# EAGLE board Room-Monitoring V.1.0 (EAGLE 7.2.0), part 1 of 2
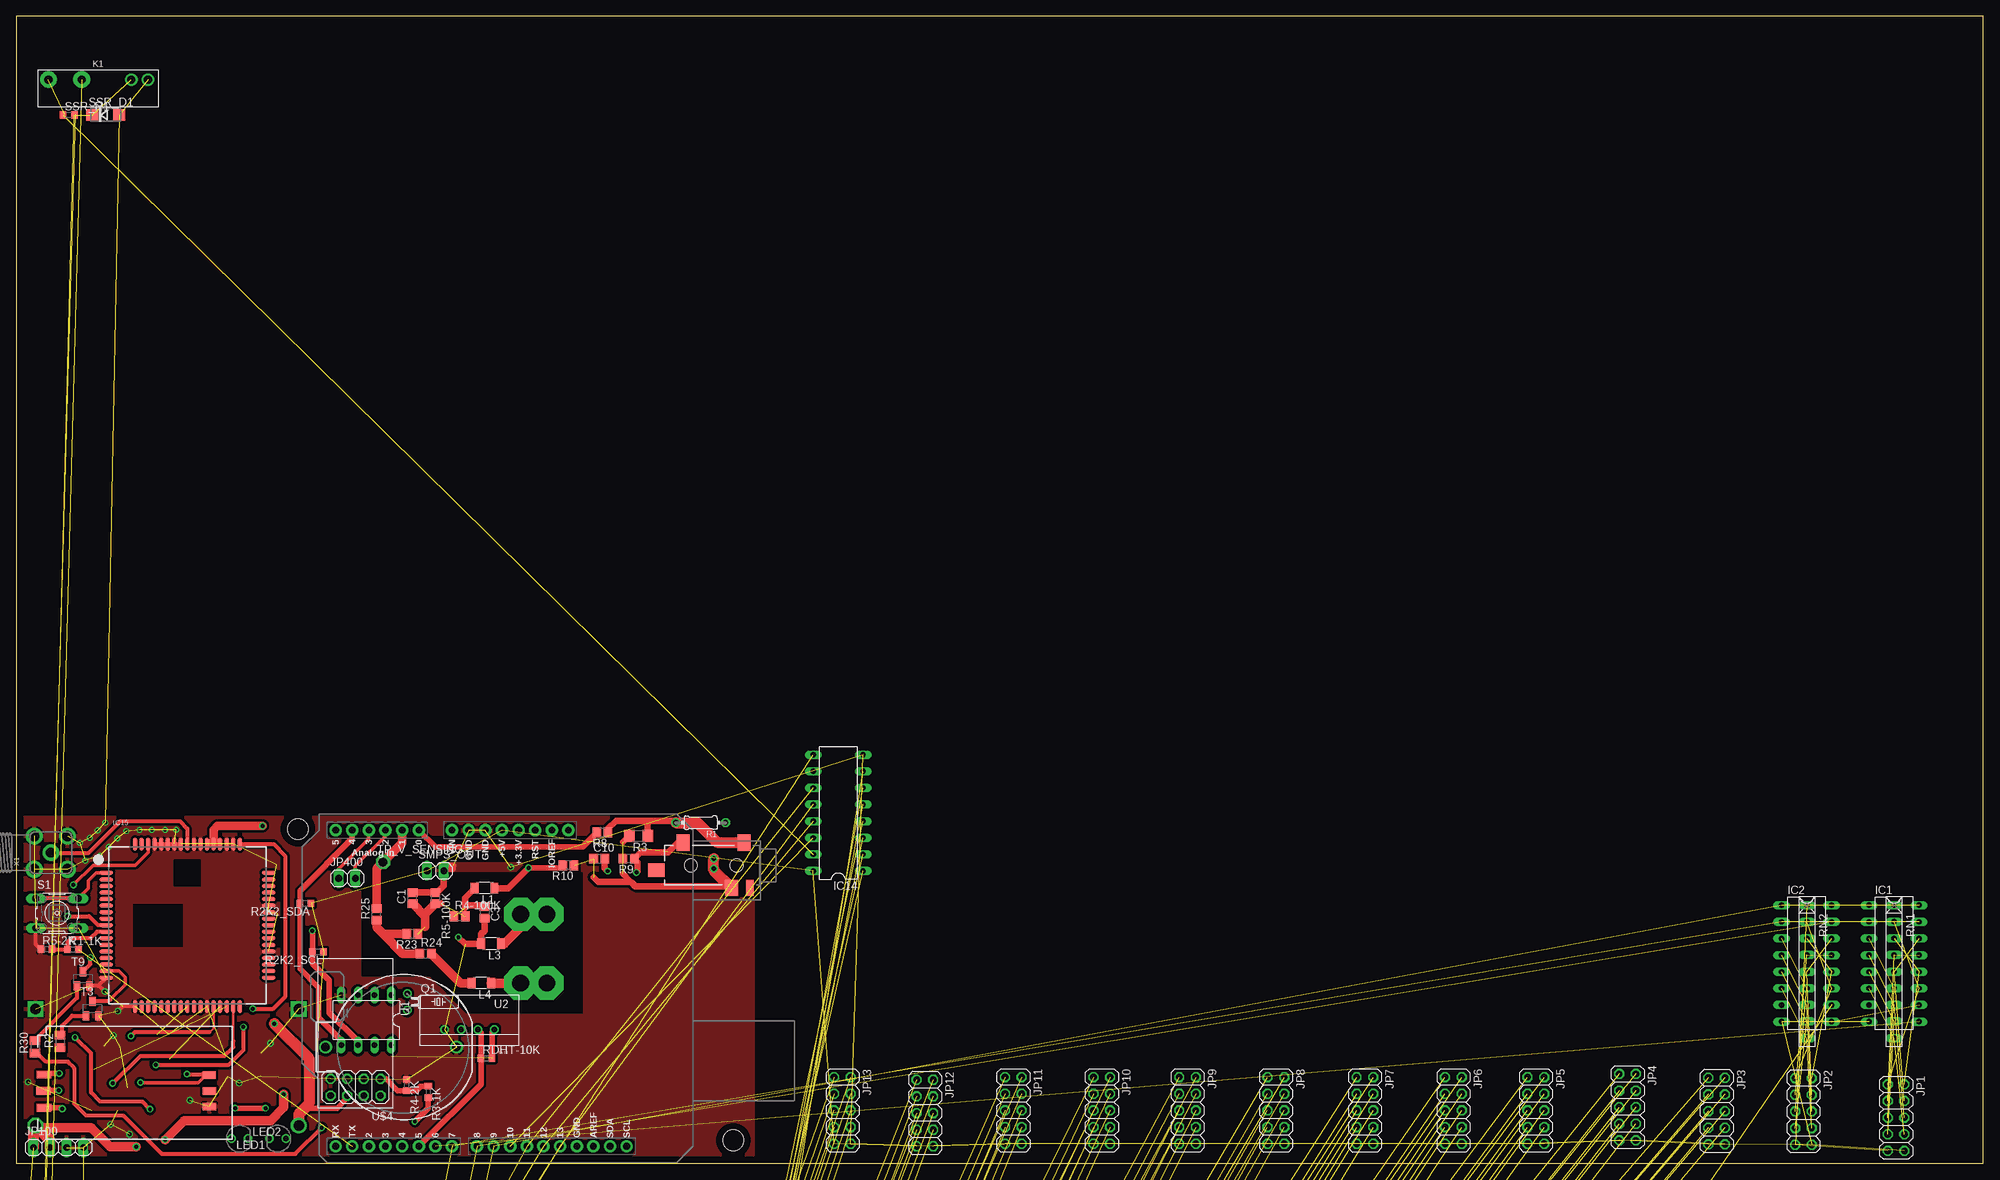
[diagram p6: board, top side]
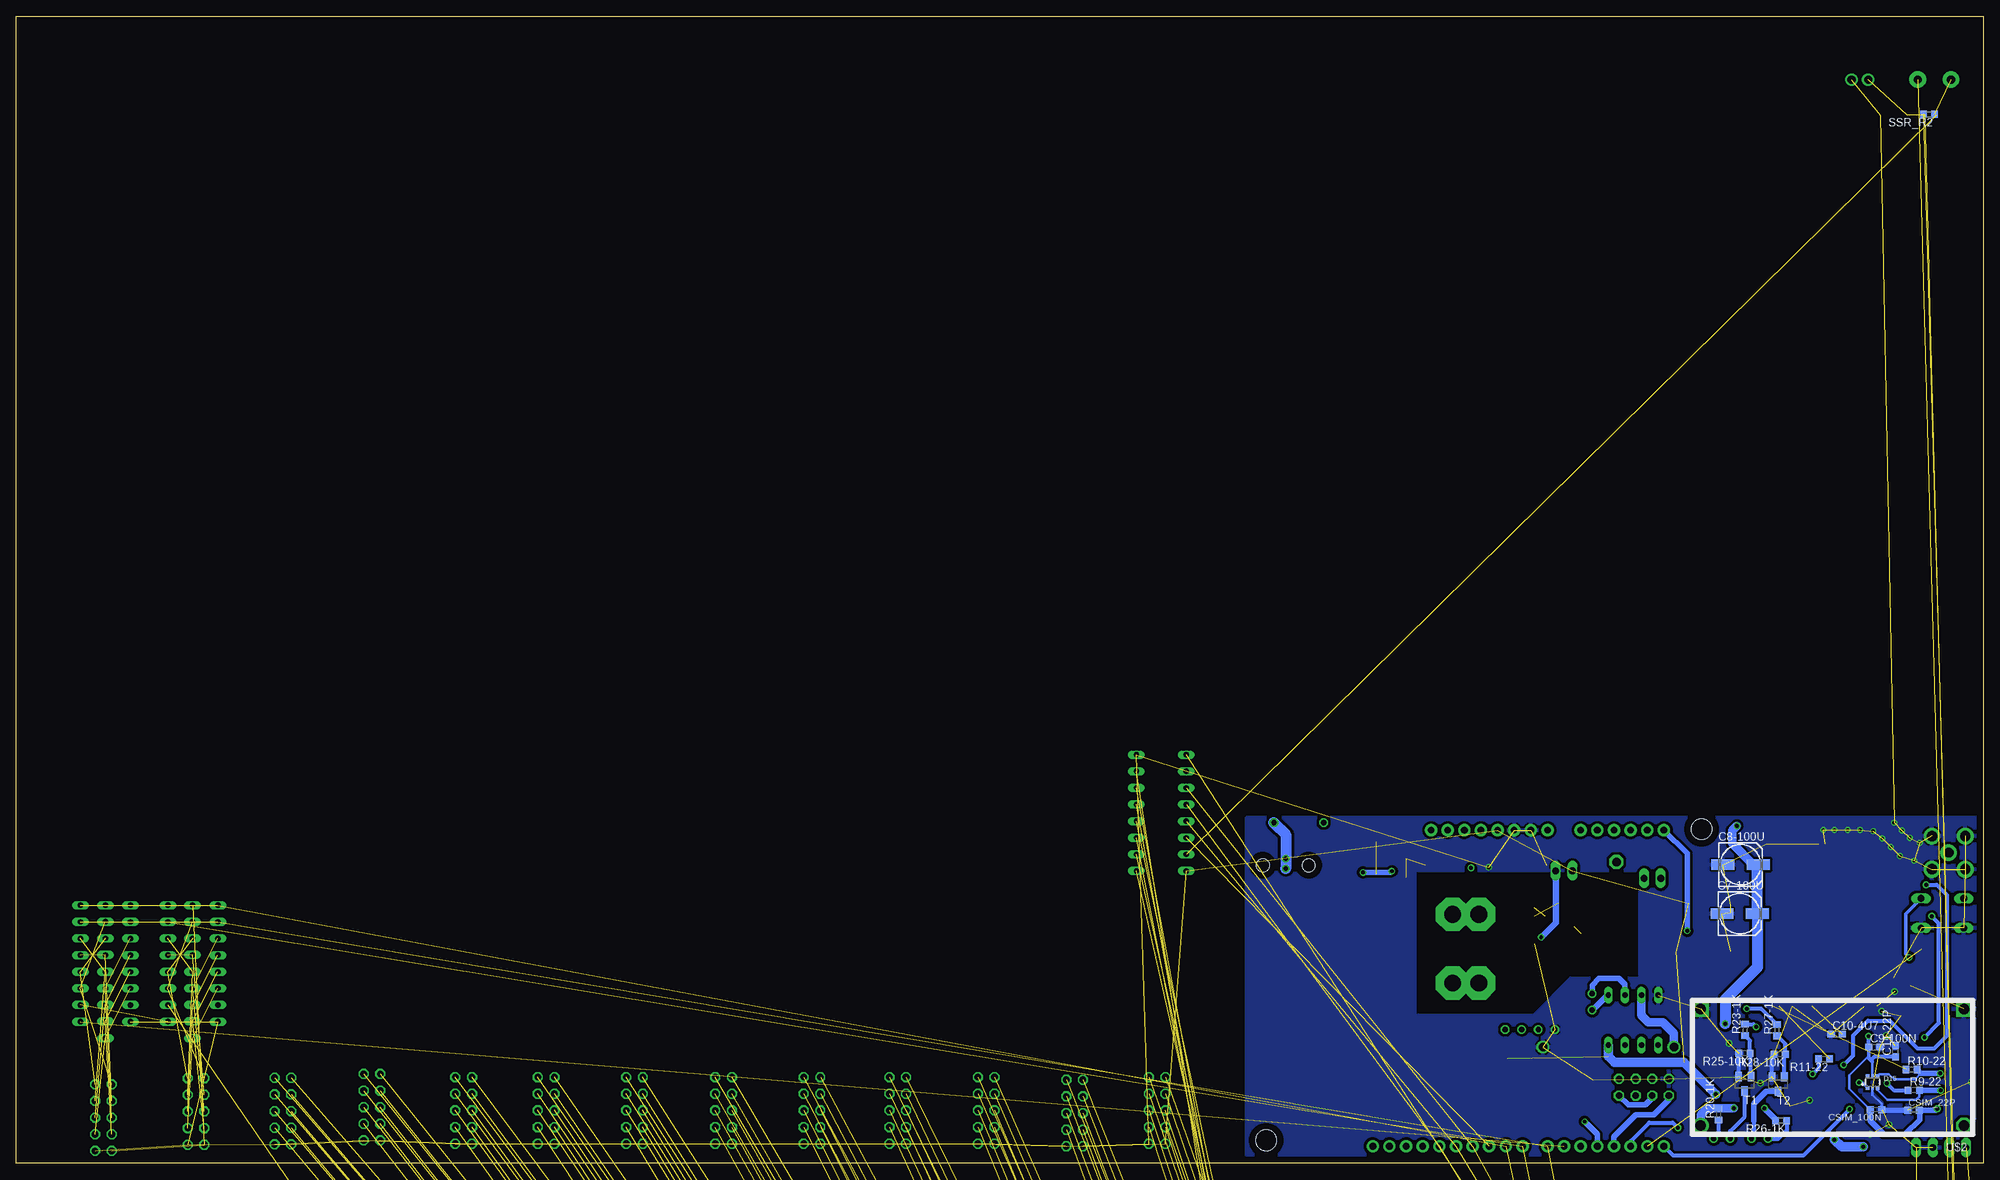
[diagram p7: board, bottom side, seen from below]

Size 300.35 x 175.16 mm. Coordinates in mm from the lower left corner, seen from the top.
Outline: 0,0 300.35,0.01 300.35,175.16 0,175.16 0,0
Copper layers (1*16): Top 0.035mm / dielectric 1.5mm / Bottom 0.035mm
Design rules "default": minimum track width 10mil, minimum drill 24mil, track to track 8mil, track to pad 8mil, pad to pad 8mil, via to via 8mil, smd to smd 8mil, copper to edge 40mil, drill to drill 8mil, minimum pad ring 10mil, minimum via ring 8mil, stop-mask expansion 4mil, vias tented up to drill 0mil, thermal gap 10mil
Net classes: 1 power: width 0.305 mm, drill 0.6 mm, clearance 0.254 mm; 2 gnd: width 0.254 mm, drill 0.6 mm, clearance 0.254 mm
Holes 3.2 mm at 43,51 109.5,3.5

## Footprints (pad centres in the part's own frame; a part is rotated, then mirrored left to right if it is on the bottom)
BATTCOM_20MM_PTH = drill 1.3: 1 11.85,0; 2 -8.15,0
C0805 = smd 1.3 x 1.5: 1 -0.85,0; 2 0.85,0
153CLV-0605 = smd 3.5 x 1.6: + 2.7,0; - -2.7,0
C0603 = smd 1.1 x 1: 1 -0.85,0; 2 0.85,0
C0603K = smd 1.05 x 1.08: 1 -0.875,0; 2 0.875,0
AUDIO-JACK-3.5MM-SMD = smd 2 x 2.5: RING 4.3,3.45; SLEEVE 2.4,-3.45; TIP 11.7,-3.45 | smd 1.2 x 2.5: RSH 1.5,3.45 | smd 2.5 x 2: TSH 15.75,0.75 | hole 2: 3.5,0; 10.5,0
SOT363 = smd 0.5 x 0.5: 1 -0.75,-0.9; 3 0.75,-0.9; 4 0.75,0.9; 6 -0.75,0.9 | smd 0.4 x 0.5: 2 0,-0.9; 5 0,0.9
DIL16 = drill 0.813 long: 1 -8.89,-3.81; 2 -6.35,-3.81; 3 -3.81,-3.81; 4 -1.27,-3.81; 5 1.27,-3.81; 6 3.81,-3.81; 7 6.35,-3.81; 8 8.89,-3.81; 9 8.89,3.81; 10 6.35,3.81; 11 3.81,3.81; 12 1.27,3.81; 13 -1.27,3.81; 14 -3.81,3.81; 15 -6.35,3.81; 16 -8.89,3.81
SIM900_SMT = smd 2 x 0.6: P$1 -12.4,8; P$2 -12.4,7; P$3 -12.4,6; P$4 -12.4,5; P$5 -12.4,4; P$6 -12.4,3; P$7 -12.4,2; P$8 -12.4,1; P$9 -12.4,0; P$10 -12.4,-1; P$11 -12.4,-2; P$12 -12.4,-3; P$13 -12.4,-4; P$14 -12.4,-5; P$15 -12.4,-6; P$16 -12.4,-7; P$17 -12.4,-8; P$35 12.4,-8; P$36 12.4,-7; P$37 12.4,-6; P$38 12.4,-5; P$39 12.4,-4; P$40 12.4,-3; P$41 12.4,-2; P$42 12.4,-1; P$43 12.4,0; P$44 12.4,1; P$45 12.4,2; P$46 12.4,3; P$47 12.4,4; P$48 12.4,5; P$49 12.4,6; P$50 12.4,7; P$51 12.4,8 | smd 0.6 x 2: P$18 -8,-12.4; P$19 -7,-12.4; P$20 -6,-12.4; P$21 -5,-12.4; P$22 -4,-12.4; P$23 -3,-12.4; P$24 -2,-12.4; P$25 -1,-12.4; P$26 0,-12.4; P$27 1,-12.4; P$28 2,-12.4; P$29 3,-12.4; P$30 4,-12.4; P$31 5,-12.4; P$32 6,-12.4; P$33 7,-12.4; P$34 8,-12.4; P$52 8,12.4; P$53 7,12.4; P$54 6,12.4; P$55 5,12.4; P$56 4,12.4; P$57 3,12.4; P$58 2,12.4; P$59 1,12.4; P$60 0,12.4; P$61 -1,12.4; P$62 -2,12.4; P$63 -3,12.4; P$64 -4,12.4; P$65 -5,12.4; P$66 -6,12.4; P$67 -7,12.4; P$68 -8,12.4
WIRE_HOLE-14AWG = drill 2.54 pad 5.08 octagon: P$1 0,0
2X05 = drill 1.016 octagon: 1 -5.08,-1.27; 2 -5.08,1.27; 3 -2.54,-1.27; 4 -2.54,1.27; 5 0,-1.27; 6 0,1.27; 7 2.54,-1.27; 8 2.54,1.27; 9 5.08,-1.27; 10 5.08,1.27
1X04 = drill 1.016 long: 1 -3.81,0; 2 -1.27,0; 3 1.27,0; 4 3.81,0
1X02 = drill 1.016 long: 1 -1.27,0; 2 1.27,0
RELAY_SX16S0X = drill 1.25 pad 2.54: 1 -7.602,0; 2 -2.522,0 | drill 1.25: 3 5.062,0; 4 7.602,0
L3216C = smd 1.2 x 1.6: 1 -1.5,0; 2 1.5,0
LED3MM-NS = drill 0.813: A -1.27,0; K 1.27,0
TC26H = drill 0.813: 1 -1.27,0; 2 1.27,0
0204/7 = drill 0.813 octagon: 1 -3.81,0; 2 3.81,0
R0603 = smd 1 x 1.1: 1 -0.85,0; 2 0.85,0
M0805 = smd 1.3 x 1.6: 1 -0.95,0; 2 0.95,0
R1206 = smd 1.6 x 1.803: 1 -1.422,0; 2 1.422,0
R0805 = smd 1.3 x 1.5: 1 -0.85,0; 2 0.85,0
RN-9 = drill 0.813 long: 1 -10.16,0; 2 -7.62,0; 3 -5.08,0; 4 -2.54,0; 5 0,0; 6 2.54,0; 7 5.08,0; 8 7.62,0; 9 10.16,0
B3F-10XX = drill 1.016 long: 1 -3.251,2.261; 2 3.251,2.261; 3 -3.251,-2.261; 4 3.251,-2.261
DO214AC = smd 1.8 x 1.7: A 2.05,0; C -2.05,0
SOT23-BEC = smd 1 x 1.4: B -0.95,-1.1; C 0,1.1; E 0.95,-1.1
P1-13 = drill 1.321 pad 2.159 octagon: TP 0,0
DIL08 = drill 0.813 long: 1 -3.81,-3.81; 2 -1.27,-3.81; 3 1.27,-3.81; 4 3.81,-3.81; 5 3.81,3.81; 6 1.27,3.81; 7 -1.27,3.81; 8 -3.81,3.81
RHT03_DHT-22 = drill 0.8: DATA -1.27,0; GND 3.81,0; NULL 1.27,0 | drill 0.8 octagon: VDD -3.81,0
UNO_R3_SHIELD = drill 1.016 pad 1.88: 3.3V 50.8,26.67; 5V 50.8,29.21; A0 50.8,41.91; A1 50.8,44.45; A2 50.8,46.99; A3 50.8,49.53; A4 50.8,52.07; A5 50.8,54.61; AREF 2.54,15.24; D2 2.54,49.53; D3 2.54,46.99; D4 2.54,44.45; D5 2.54,41.91; D6 2.54,39.37; D7 2.54,36.83; D8 2.54,33.02; D9 2.54,30.48; D10 2.54,27.94; D11 2.54,25.4; D12 2.54,22.86; D13 2.54,20.32; GND@0 50.8,31.75; GND@1 50.8,34.29; GND@2 2.54,17.78; IOREF 50.8,21.59; NC 50.8,19.05; RES 50.8,24.13; RX 2.54,54.61; SCL 2.54,10.16; SDA 2.54,12.7; TX 2.54,52.07; VIN 50.8,36.83
DCDCMODULE = drill 1.6 square: GND#0 1.7,1.7; GND#1 41.9,1.7 | drill 1.6 octagon: VIN 1.7,19.5 | drill 1.6: VOUT 41.9,19.5
ESP8266 = drill 1.016 octagon: CHPD 1.27,1.27; GND 3.81,-1.27; IO0 -1.27,-1.27; IO2 1.27,-1.27; RST -1.27,1.27; RXD -3.81,-1.27; TXD 3.81,1.27; VCC -3.81,1.27
SIMHOLDER3 = smd 2.2 x 1.2: 1 0.95,4.81; 2 0.91,7.41; 3 0.95,9.86 | smd 2 x 1.2: 4 26.2,9.78; 5 26.22,7.34; 6 26.22,4.98
SMA90_DIP = drill 1.5 pad 2.54: ANTENNA 0,0 | drill 1.6 pad 2.54: GND1 -2.54,2.54; GND2 2.54,2.54; GND3 -2.54,-2.54; GND4 2.54,-2.54

## Placement (x,y rotation side)
BAT1  [BATTCOM_20MM_PTH]  59.08,17.73 180 top
C1  C10uF  [C0805]  60.5,40.5 90 top
C3  C10uF  [C0805]  71.5,38.3 270 top
C7-100U  [153CLV-0605]  37.17,38.1 0 bottom
C8-100U  [153CLV-0605]  37.03,45.58 0 bottom
C9-100N  [C0603]  16.62,17.75 0 bottom
C10  10uF  [C0805]  89,46.5 0 top
C10-4U7  [C0603]  22.38,19.7 0 bottom
C11-22P  [C0603]  13.38,17.09 90 bottom
CSIM_22P  [C0603K]  10.61,8.1 0 bottom
CSIM_100N  [C0603K]  16.35,8.17 180 bottom
CUR_SENS_JACK  [AUDIO-JACK-3.5MM-SMD]  113.5,45.5 180 top
D15  [SOT363]  16.89,12.39 0 bottom
IC1  74HC165N  [DIL16]  286.75,30.5 270 top
IC2  74HC165N  [DIL16]  273.4,30.5 270 top
IC3  74HC165N  [DIL16]  not placed on the board
IC4  74HC165N  [DIL16]  not placed on the board
IC5  74HC165N  [DIL16]  not placed on the board
IC6  74HC165N  [DIL16]  not placed on the board
IC7  74HC165N  [DIL16]  not placed on the board
IC8  74HC165N  [DIL16]  not placed on the board
IC9  74HC165N  [DIL16]  not placed on the board
IC10  74HC165N  [DIL16]  not placed on the board
IC11  74HC165N  [DIL16]  not placed on the board
IC12  74HC165N  [DIL16]  not placed on the board
IC13  74HC165N  [DIL16]  not placed on the board
IC14  74HC595N  [DIL16]  125.5,53.5 90 top
IC15  [SIM900_SMT]  26.12,36.34 0 top
IC16  74HC595N  [DIL16]  not placed on the board
IC17  74HC595N  [DIL16]  not placed on the board
IC18  74HC595N  [DIL16]  not placed on the board
IC19  74HC595N  [DIL16]  not placed on the board
IC20  74HC595N  [DIL16]  not placed on the board
IC21  74HC595N  [DIL16]  not placed on the board
IC22  74HC595N  [DIL16]  not placed on the board
IC23  74HC595N  [DIL16]  not placed on the board
IC24  74HC595N  [DIL16]  not placed on the board
IC25  74HC595N  [DIL16]  not placed on the board
IC26  74HC595N  [DIL16]  not placed on the board
IC27  74HC595N  [DIL16]  not placed on the board
J1  WIRE_HOLE-14AWG  [WIRE_HOLE-14AWG]  77,38 90 top
J2  WIRE_HOLE-14AWG  [WIRE_HOLE-14AWG]  77,27.5 0 top
J3  WIRE_HOLE-14AWG  [WIRE_HOLE-14AWG]  81,27.5 90 top
J4  WIRE_HOLE-14AWG  [WIRE_HOLE-14AWG]  81,38 90 top
JP1  [2X05]  287.05,6.95 270 top
JP2  [2X05]  272.9,7.9 270 top
JP3  [2X05]  259.65,7.95 270 top
JP4  [2X05]  246.05,8.55 270 top
JP5  [2X05]  232.05,8.05 270 top
JP6  [2X05]  219.45,8.05 270 top
JP7  [2X05]  205.95,8.05 270 top
JP8  [2X05]  192.35,8.05 270 top
JP9  [2X05]  178.85,8.05 270 top
JP10  [2X05]  165.75,8.05 270 top
JP11  [2X05]  152.25,8.05 270 top
JP12  [2X05]  138.75,7.65 270 top
JP13  [2X05]  126.15,8.05 270 top
JP100  [1X04]  6.42,2.38 0 top
JP400  [1X02]  50.5,43.5 0 top
K1  S216S01F  [RELAY_SX16S0X]  12.5,165.5 0 top
K2  S216S01F  [RELAY_SX16S0X]  not placed on the board
K3  S216S01F  [RELAY_SX16S0X]  not placed on the board
K4  S216S01F  [RELAY_SX16S0X]  not placed on the board
K5  S216S01F  [RELAY_SX16S0X]  not placed on the board
K6  S216S01F  [RELAY_SX16S0X]  not placed on the board
K7  S216S01F  [RELAY_SX16S0X]  not placed on the board
K8  S216S01F  [RELAY_SX16S0X]  not placed on the board
K9  S216S01F  [RELAY_SX16S0X]  not placed on the board
K10  S216S01F  [RELAY_SX16S0X]  not placed on the board
K11  S216S01F  [RELAY_SX16S0X]  not placed on the board
K12  S216S01F  [RELAY_SX16S0X]  not placed on the board
K13  S216S01F  [RELAY_SX16S0X]  not placed on the board
K14  S216S01F  [RELAY_SX16S0X]  not placed on the board
K15  S216S01F  [RELAY_SX16S0X]  not placed on the board
K16  S216S01F  [RELAY_SX16S0X]  not placed on the board
K17  S216S01F  [RELAY_SX16S0X]  not placed on the board
K18  S216S01F  [RELAY_SX16S0X]  not placed on the board
K19  S216S01F  [RELAY_SX16S0X]  not placed on the board
K20  S216S01F  [RELAY_SX16S0X]  not placed on the board
K21  S216S01F  [RELAY_SX16S0X]  not placed on the board
K22  S216S01F  [RELAY_SX16S0X]  not placed on the board
K23  S216S01F  [RELAY_SX16S0X]  not placed on the board
K24  S216S01F  [RELAY_SX16S0X]  not placed on the board
K25  S216S01F  [RELAY_SX16S0X]  not placed on the board
K26  S216S01F  [RELAY_SX16S0X]  not placed on the board
K27  S216S01F  [RELAY_SX16S0X]  not placed on the board
K28  S216S01F  [RELAY_SX16S0X]  not placed on the board
K29  S216S01F  [RELAY_SX16S0X]  not placed on the board
K30  S216S01F  [RELAY_SX16S0X]  not placed on the board
K31  S216S01F  [RELAY_SX16S0X]  not placed on the board
K32  S216S01F  [RELAY_SX16S0X]  not placed on the board
K33  S216S01F  [RELAY_SX16S0X]  not placed on the board
K34  S216S01F  [RELAY_SX16S0X]  not placed on the board
K35  S216S01F  [RELAY_SX16S0X]  not placed on the board
K36  S216S01F  [RELAY_SX16S0X]  not placed on the board
K37  S216S01F  [RELAY_SX16S0X]  not placed on the board
K38  S216S01F  [RELAY_SX16S0X]  not placed on the board
K39  S216S01F  [RELAY_SX16S0X]  not placed on the board
K40  S216S01F  [RELAY_SX16S0X]  not placed on the board
K41  S216S01F  [RELAY_SX16S0X]  not placed on the board
K42  S216S01F  [RELAY_SX16S0X]  not placed on the board
K43  S216S01F  [RELAY_SX16S0X]  not placed on the board
K44  S216S01F  [RELAY_SX16S0X]  not placed on the board
K45  S216S01F  [RELAY_SX16S0X]  not placed on the board
K46  S216S01F  [RELAY_SX16S0X]  not placed on the board
K47  S216S01F  [RELAY_SX16S0X]  not placed on the board
K48  S216S01F  [RELAY_SX16S0X]  not placed on the board
K49  S216S01F  [RELAY_SX16S0X]  not placed on the board
K50  S216S01F  [RELAY_SX16S0X]  not placed on the board
K51  S216S01F  [RELAY_SX16S0X]  not placed on the board
K52  S216S01F  [RELAY_SX16S0X]  not placed on the board
K53  S216S01F  [RELAY_SX16S0X]  not placed on the board
K54  S216S01F  [RELAY_SX16S0X]  not placed on the board
K55  S216S01F  [RELAY_SX16S0X]  not placed on the board
K56  S216S01F  [RELAY_SX16S0X]  not placed on the board
K57  S216S01F  [RELAY_SX16S0X]  not placed on the board
K58  S216S01F  [RELAY_SX16S0X]  not placed on the board
K59  S216S01F  [RELAY_SX16S0X]  not placed on the board
K60  S216S01F  [RELAY_SX16S0X]  not placed on the board
K61  S216S01F  [RELAY_SX16S0X]  not placed on the board
K62  S216S01F  [RELAY_SX16S0X]  not placed on the board
K63  S216S01F  [RELAY_SX16S0X]  not placed on the board
K64  S216S01F  [RELAY_SX16S0X]  not placed on the board
K65  S216S01F  [RELAY_SX16S0X]  not placed on the board
K66  S216S01F  [RELAY_SX16S0X]  not placed on the board
K67  S216S01F  [RELAY_SX16S0X]  not placed on the board
K68  S216S01F  [RELAY_SX16S0X]  not placed on the board
K69  S216S01F  [RELAY_SX16S0X]  not placed on the board
K70  S216S01F  [RELAY_SX16S0X]  not placed on the board
K71  S216S01F  [RELAY_SX16S0X]  not placed on the board
K72  S216S01F  [RELAY_SX16S0X]  not placed on the board
K73  S216S01F  [RELAY_SX16S0X]  not placed on the board
K74  S216S01F  [RELAY_SX16S0X]  not placed on the board
K75  S216S01F  [RELAY_SX16S0X]  not placed on the board
K76  S216S01F  [RELAY_SX16S0X]  not placed on the board
K77  S216S01F  [RELAY_SX16S0X]  not placed on the board
K78  S216S01F  [RELAY_SX16S0X]  not placed on the board
K79  S216S01F  [RELAY_SX16S0X]  not placed on the board
K80  S216S01F  [RELAY_SX16S0X]  not placed on the board
K81  S216S01F  [RELAY_SX16S0X]  not placed on the board
K82  S216S01F  [RELAY_SX16S0X]  not placed on the board
K83  S216S01F  [RELAY_SX16S0X]  not placed on the board
K84  S216S01F  [RELAY_SX16S0X]  not placed on the board
K85  S216S01F  [RELAY_SX16S0X]  not placed on the board
K86  S216S01F  [RELAY_SX16S0X]  not placed on the board
K87  S216S01F  [RELAY_SX16S0X]  not placed on the board
K88  S216S01F  [RELAY_SX16S0X]  not placed on the board
K89  S216S01F  [RELAY_SX16S0X]  not placed on the board
K90  S216S01F  [RELAY_SX16S0X]  not placed on the board
K91  S216S01F  [RELAY_SX16S0X]  not placed on the board
K92  S216S01F  [RELAY_SX16S0X]  not placed on the board
K93  S216S01F  [RELAY_SX16S0X]  not placed on the board
K94  S216S01F  [RELAY_SX16S0X]  not placed on the board
K95  S216S01F  [RELAY_SX16S0X]  not placed on the board
K96  S216S01F  [RELAY_SX16S0X]  not placed on the board
K97  S216S01F  [RELAY_SX16S0X]  not placed on the board
K98  S216S01F  [RELAY_SX16S0X]  not placed on the board
K99  S216S01F  [RELAY_SX16S0X]  not placed on the board
K100  S216S01F  [RELAY_SX16S0X]  not placed on the board
L1  BLM31PG330SN1  [L3216C]  71.5,42 180 top
L3  BLM31PG330SN1  [L3216C]  72.5,33.5 180 top
L4  BLM31PG330SN1  [L3216C]  71,27.5 180 top
LED1  [LED3MM-NS]  39.89,3.76 180 top
LED2  [LED3MM-NS]  34.12,3.74 0 top
Q1  [TC26H]  59.71,24.63 270 top
R1  120R  [0204/7]  104.5,52 180 top
R1-1K  [R0603]  8.63,32.64 0 top
R2  R120  [M0805]  6.66,18.6 90 top
R2K2_SCL  [R0603]  46.07,32.27 180 top
R2K2_SDA  [R0603]  44.16,39.67 180 top
R3  120R  [R1206]  95,50 180 top
R3-1K  [R0603]  62.91,10.9 270 top
R4-2K  [R0603]  59.6,11.91 270 top
R4-100K  [R0805]  67.7,37.7 0 top
R5-2K  [R0603]  4.58,32.68 0 top
R5-100K  [R0805]  64,40.5 270 top
R8  1K  [R0805]  89.5,50.5 180 top
R9  470K  [R0805]  93.5,46.5 180 top
R9-22  [R0603]  10.59,11.15 0 bottom
R10  470K  [R0805]  84.3,45.5 180 top
R10-22  [R0603]  10.93,14.3 0 bottom
R11-22  [R0603]  24.28,15.92 180 bottom
R20-1K  [R0603]  40.39,7.46 90 bottom
R23  R1K  [R0805]  60.5,35 180 top
R23-1K  [R0603]  36.37,20.37 90 bottom
R24  R499K  [R0805]  62.5,32 0 top
R25  R1K  [R0805]  55,38 90 top
R25-10K  [R0603]  36.46,16.8 180 bottom
R26-1K  [R0603]  30.87,6.49 180 bottom
R27-1K  [R0603]  31.46,20.3 90 bottom
R28-10K  [R0603]  31.06,16.64 180 bottom
R30  R120  [M0805]  2.85,17.75 90 top
RDHT-10K  [R0603]  71.8,16 0 top
RN1  [RN-9]  286.75,29.25 270 top
RN2  [RN-9]  273.45,29.25 270 top
RN3  [RN-9]  not placed on the board
RN4  [RN-9]  not placed on the board
RN5  [RN-9]  not placed on the board
RN6  [RN-9]  not placed on the board
RN7  [RN-9]  not placed on the board
RN8  [RN-9]  not placed on the board
RN9  [RN-9]  not placed on the board
RN10  [RN-9]  not placed on the board
RN11  [RN-9]  not placed on the board
RN12  [RN-9]  not placed on the board
RN13  [RN-9]  not placed on the board
S1  [B3F-10XX]  6.21,38.18 0 top
SMPS_OUT  [1X02]  64,44.65 0 top
SSR_C1  C10uF  [C0805]  not placed on the board
SSR_C2  C10uF  [C0805]  not placed on the board
SSR_C3  C10uF  [C0805]  not placed on the board
SSR_C4  C10uF  [C0805]  not placed on the board
SSR_C5  C10uF  [C0805]  not placed on the board
SSR_C6  C10uF  [C0805]  not placed on the board
SSR_C7  C10uF  [C0805]  not placed on the board
SSR_C8  C10uF  [C0805]  not placed on the board
SSR_C9  C10uF  [C0805]  not placed on the board
SSR_C10  C10uF  [C0805]  not placed on the board
SSR_C11  C10uF  [C0805]  not placed on the board
SSR_C12  C10uF  [C0805]  not placed on the board
SSR_C13  C10uF  [C0805]  not placed on the board
SSR_C14  C10uF  [C0805]  not placed on the board
SSR_C15  C10uF  [C0805]  not placed on the board
SSR_C16  C10uF  [C0805]  not placed on the board
SSR_C17  C10uF  [C0805]  not placed on the board
SSR_C18  C10uF  [C0805]  not placed on the board
SSR_C19  C10uF  [C0805]  not placed on the board
SSR_C20  C10uF  [C0805]  not placed on the board
SSR_C21  C10uF  [C0805]  not placed on the board
SSR_C22  C10uF  [C0805]  not placed on the board
SSR_C23  C10uF  [C0805]  not placed on the board
SSR_C24  C10uF  [C0805]  not placed on the board
SSR_C25  C10uF  [C0805]  not placed on the board
SSR_C26  C10uF  [C0805]  not placed on the board
SSR_C27  C10uF  [C0805]  not placed on the board
SSR_C28  C10uF  [C0805]  not placed on the board
SSR_C29  C10uF  [C0805]  not placed on the board
SSR_C30  C10uF  [C0805]  not placed on the board
SSR_C31  C10uF  [C0805]  not placed on the board
SSR_C32  C10uF  [C0805]  not placed on the board
SSR_C33  C10uF  [C0805]  not placed on the board
SSR_C34  C10uF  [C0805]  not placed on the board
SSR_C35  C10uF  [C0805]  not placed on the board
SSR_C36  C10uF  [C0805]  not placed on the board
SSR_C37  C10uF  [C0805]  not placed on the board
SSR_C38  C10uF  [C0805]  not placed on the board
SSR_C39  C10uF  [C0805]  not placed on the board
SSR_C40  C10uF  [C0805]  not placed on the board
SSR_C41  C10uF  [C0805]  not placed on the board
SSR_C42  C10uF  [C0805]  not placed on the board
SSR_C43  C10uF  [C0805]  not placed on the board
SSR_C44  C10uF  [C0805]  not placed on the board
SSR_C45  C10uF  [C0805]  not placed on the board
SSR_C46  C10uF  [C0805]  not placed on the board
SSR_C47  C10uF  [C0805]  not placed on the board
SSR_C48  C10uF  [C0805]  not placed on the board
SSR_C49  C10uF  [C0805]  not placed on the board
SSR_C50  C10uF  [C0805]  not placed on the board
SSR_C51  C10uF  [C0805]  not placed on the board
SSR_C52  C10uF  [C0805]  not placed on the board
SSR_C53  C10uF  [C0805]  not placed on the board
SSR_C54  C10uF  [C0805]  not placed on the board
SSR_C55  C10uF  [C0805]  not placed on the board
SSR_C56  C10uF  [C0805]  not placed on the board
SSR_C57  C10uF  [C0805]  not placed on the board
SSR_C58  C10uF  [C0805]  not placed on the board
SSR_C59  C10uF  [C0805]  not placed on the board
SSR_C60  C10uF  [C0805]  not placed on the board
SSR_C61  C10uF  [C0805]  not placed on the board
SSR_C62  C10uF  [C0805]  not placed on the board
SSR_C63  C10uF  [C0805]  not placed on the board
SSR_C64  C10uF  [C0805]  not placed on the board
SSR_C65  C10uF  [C0805]  not placed on the board
SSR_C66  C10uF  [C0805]  not placed on the board
SSR_C67  C10uF  [C0805]  not placed on the board
SSR_C68  C10uF  [C0805]  not placed on the board
SSR_C69  C10uF  [C0805]  not placed on the board
SSR_C70  C10uF  [C0805]  not placed on the board
SSR_C71  C10uF  [C0805]  not placed on the board
SSR_C72  C10uF  [C0805]  not placed on the board
SSR_C73  C10uF  [C0805]  not placed on the board
SSR_C74  C10uF  [C0805]  not placed on the board
SSR_C75  C10uF  [C0805]  not placed on the board
SSR_C76  C10uF  [C0805]  not placed on the board
SSR_C77  C10uF  [C0805]  not placed on the board
SSR_C78  C10uF  [C0805]  not placed on the board
SSR_C79  C10uF  [C0805]  not placed on the board
SSR_C80  C10uF  [C0805]  not placed on the board
SSR_C81  C10uF  [C0805]  not placed on the board
SSR_C82  C10uF  [C0805]  not placed on the board
SSR_C83  C10uF  [C0805]  not placed on the board
SSR_C84  C10uF  [C0805]  not placed on the board
SSR_C85  C10uF  [C0805]  not placed on the board
SSR_C86  C10uF  [C0805]  not placed on the board
SSR_C87  C10uF  [C0805]  not placed on the board
SSR_C88  C10uF  [C0805]  not placed on the board
SSR_C89  C10uF  [C0805]  not placed on the board
SSR_C90  C10uF  [C0805]  not placed on the board
SSR_C91  C10uF  [C0805]  not placed on the board
SSR_C92  C10uF  [C0805]  not placed on the board
SSR_C93  C10uF  [C0805]  not placed on the board
SSR_C94  C10uF  [C0805]  not placed on the board
SSR_C95  C10uF  [C0805]  not placed on the board
SSR_C96  C10uF  [C0805]  not placed on the board
SSR_C97  C10uF  [C0805]  not placed on the board
SSR_C98  C10uF  [C0805]  not placed on the board
SSR_C99  C10uF  [C0805]  not placed on the board
SSR_C100  C10uF  [C0805]  not placed on the board
SSR_C101  C10uF  [C0805]  not placed on the board
SSR_C102  C10uF  [C0805]  not placed on the board
SSR_C103  C10uF  [C0805]  not placed on the board
SSR_C104  C10uF  [C0805]  not placed on the board
SSR_C105  C10uF  [C0805]  not placed on the board
SSR_C106  C10uF  [C0805]  not placed on the board
SSR_C107  C10uF  [C0805]  not placed on the board
SSR_C108  C10uF  [C0805]  not placed on the board
SSR_C109  C10uF  [C0805]  not placed on the board
SSR_C110  C10uF  [C0805]  not placed on the board
SSR_C111  C10uF  [C0805]  not placed on the board
SSR_C112  C10uF  [C0805]  not placed on the board
SSR_C113  C10uF  [C0805]  not placed on the board
SSR_C114  C10uF  [C0805]  not placed on the board
SSR_C115  C10uF  [C0805]  not placed on the board
SSR_C116  C10uF  [C0805]  not placed on the board
SSR_C117  C10uF  [C0805]  not placed on the board
SSR_C118  C10uF  [C0805]  not placed on the board
SSR_C119  C10uF  [C0805]  not placed on the board
SSR_C120  C10uF  [C0805]  not placed on the board
SSR_C121  C10uF  [C0805]  not placed on the board
SSR_C122  C10uF  [C0805]  not placed on the board
SSR_C123  C10uF  [C0805]  not placed on the board
SSR_C124  C10uF  [C0805]  not placed on the board
SSR_C125  C10uF  [C0805]  not placed on the board
SSR_C126  C10uF  [C0805]  not placed on the board
SSR_C127  C10uF  [C0805]  not placed on the board
SSR_C128  C10uF  [C0805]  not placed on the board
SSR_C129  C10uF  [C0805]  not placed on the board
SSR_C130  C10uF  [C0805]  not placed on the board
SSR_C131  C10uF  [C0805]  not placed on the board
SSR_C132  C10uF  [C0805]  not placed on the board
SSR_C133  C10uF  [C0805]  not placed on the board
SSR_C134  C10uF  [C0805]  not placed on the board
SSR_C135  C10uF  [C0805]  not placed on the board
SSR_C136  C10uF  [C0805]  not placed on the board
SSR_C137  C10uF  [C0805]  not placed on the board
SSR_C138  C10uF  [C0805]  not placed on the board
SSR_C139  C10uF  [C0805]  not placed on the board
SSR_C140  C10uF  [C0805]  not placed on the board
SSR_C141  C10uF  [C0805]  not placed on the board
SSR_C142  C10uF  [C0805]  not placed on the board
SSR_C143  C10uF  [C0805]  not placed on the board
SSR_C144  C10uF  [C0805]  not placed on the board
SSR_C145  C10uF  [C0805]  not placed on the board
SSR_C146  C10uF  [C0805]  not placed on the board
SSR_C147  C10uF  [C0805]  not placed on the board
SSR_C148  C10uF  [C0805]  not placed on the board
SSR_C149  C10uF  [C0805]  not placed on the board
SSR_C150  C10uF  [C0805]  not placed on the board
SSR_C151  C10uF  [C0805]  not placed on the board
SSR_C152  C10uF  [C0805]  not placed on the board
SSR_C153  C10uF  [C0805]  not placed on the board
SSR_C154  C10uF  [C0805]  not placed on the board
SSR_C155  C10uF  [C0805]  not placed on the board
SSR_C156  C10uF  [C0805]  not placed on the board
SSR_C157  C10uF  [C0805]  not placed on the board
SSR_C158  C10uF  [C0805]  not placed on the board
SSR_C159  C10uF  [C0805]  not placed on the board
SSR_C160  C10uF  [C0805]  not placed on the board
SSR_C161  C10uF  [C0805]  not placed on the board
SSR_C162  C10uF  [C0805]  not placed on the board
SSR_C163  C10uF  [C0805]  not placed on the board
SSR_C164  C10uF  [C0805]  not placed on the board
SSR_C165  C10uF  [C0805]  not placed on the board
SSR_C166  C10uF  [C0805]  not placed on the board
SSR_C167  C10uF  [C0805]  not placed on the board
SSR_C168  C10uF  [C0805]  not placed on the board
SSR_C169  C10uF  [C0805]  not placed on the board
SSR_C170  C10uF  [C0805]  not placed on the board
SSR_C171  C10uF  [C0805]  not placed on the board
SSR_C172  C10uF  [C0805]  not placed on the board
SSR_C173  C10uF  [C0805]  not placed on the board
SSR_C174  C10uF  [C0805]  not placed on the board
SSR_C175  C10uF  [C0805]  not placed on the board
SSR_C176  C10uF  [C0805]  not placed on the board
SSR_C177  C10uF  [C0805]  not placed on the board
SSR_C178  C10uF  [C0805]  not placed on the board
SSR_C179  C10uF  [C0805]  not placed on the board
SSR_C180  C10uF  [C0805]  not placed on the board
SSR_C181  C10uF  [C0805]  not placed on the board
SSR_C182  C10uF  [C0805]  not placed on the board
SSR_C183  C10uF  [C0805]  not placed on the board
SSR_C184  C10uF  [C0805]  not placed on the board
SSR_C185  C10uF  [C0805]  not placed on the board
SSR_C186  C10uF  [C0805]  not placed on the board
SSR_C187  C10uF  [C0805]  not placed on the board
SSR_C188  C10uF  [C0805]  not placed on the board
SSR_C189  C10uF  [C0805]  not placed on the board
SSR_C190  C10uF  [C0805]  not placed on the board
SSR_C191  C10uF  [C0805]  not placed on the board
SSR_C192  C10uF  [C0805]  not placed on the board
SSR_C193  C10uF  [C0805]  not placed on the board
SSR_C194  C10uF  [C0805]  not placed on the board
SSR_C195  C10uF  [C0805]  not placed on the board
SSR_C196  C10uF  [C0805]  not placed on the board
SSR_C197  C10uF  [C0805]  not placed on the board
SSR_C198  C10uF  [C0805]  not placed on the board
SSR_C199  C10uF  [C0805]  not placed on the board
SSR_C200  C10uF  [C0805]  not placed on the board
SSR_D1  [DO214AC]  13.65,160.1 0 top
SSR_D2  [DO214AC]  not placed on the board
SSR_D3  [DO214AC]  not placed on the board
SSR_D4  [DO214AC]  not placed on the board
SSR_D5  [DO214AC]  not placed on the board
SSR_D6  [DO214AC]  not placed on the board
SSR_D7  [DO214AC]  not placed on the board
SSR_D8  [DO214AC]  not placed on the board
SSR_D9  [DO214AC]  not placed on the board
SSR_D10  [DO214AC]  not placed on the board
SSR_D11  [DO214AC]  not placed on the board
SSR_D12  [DO214AC]  not placed on the board
SSR_D13  [DO214AC]  not placed on the board
SSR_D14  [DO214AC]  not placed on the board
SSR_D15  [DO214AC]  not placed on the board
SSR_D16  [DO214AC]  not placed on the board
SSR_D17  [DO214AC]  not placed on the board
SSR_D18  [DO214AC]  not placed on the board
SSR_D19  [DO214AC]  not placed on the board
SSR_D20  [DO214AC]  not placed on the board
SSR_D21  [DO214AC]  not placed on the board
SSR_D22  [DO214AC]  not placed on the board
SSR_D23  [DO214AC]  not placed on the board
SSR_D24  [DO214AC]  not placed on the board
SSR_D25  [DO214AC]  not placed on the board
SSR_D26  [DO214AC]  not placed on the board
SSR_D27  [DO214AC]  not placed on the board
SSR_D28  [DO214AC]  not placed on the board
SSR_D29  [DO214AC]  not placed on the board
SSR_D30  [DO214AC]  not placed on the board
SSR_D31  [DO214AC]  not placed on the board
SSR_D32  [DO214AC]  not placed on the board
SSR_D33  [DO214AC]  not placed on the board
SSR_D34  [DO214AC]  not placed on the board
SSR_D35  [DO214AC]  not placed on the board
SSR_D36  [DO214AC]  not placed on the board
SSR_D37  [DO214AC]  not placed on the board
SSR_D38  [DO214AC]  not placed on the board
SSR_D39  [DO214AC]  not placed on the board
SSR_D40  [DO214AC]  not placed on the board
SSR_D41  [DO214AC]  not placed on the board
SSR_D42  [DO214AC]  not placed on the board
SSR_D43  [DO214AC]  not placed on the board
SSR_D44  [DO214AC]  not placed on the board
SSR_D45  [DO214AC]  not placed on the board
SSR_D46  [DO214AC]  not placed on the board
SSR_D47  [DO214AC]  not placed on the board
SSR_D48  [DO214AC]  not placed on the board
SSR_D49  [DO214AC]  not placed on the board
SSR_D50  [DO214AC]  not placed on the board
SSR_D51  [DO214AC]  not placed on the board
SSR_D52  [DO214AC]  not placed on the board
SSR_D53  [DO214AC]  not placed on the board
SSR_D54  [DO214AC]  not placed on the board
SSR_D55  [DO214AC]  not placed on the board
SSR_D56  [DO214AC]  not placed on the board
SSR_D57  [DO214AC]  not placed on the board
SSR_D58  [DO214AC]  not placed on the board
SSR_D59  [DO214AC]  not placed on the board
SSR_D60  [DO214AC]  not placed on the board
SSR_D61  [DO214AC]  not placed on the board
SSR_D62  [DO214AC]  not placed on the board
SSR_D63  [DO214AC]  not placed on the board
SSR_D64  [DO214AC]  not placed on the board
SSR_D65  [DO214AC]  not placed on the board
SSR_D66  [DO214AC]  not placed on the board
SSR_D67  [DO214AC]  not placed on the board
SSR_D68  [DO214AC]  not placed on the board
SSR_D69  [DO214AC]  not placed on the board
SSR_D70  [DO214AC]  not placed on the board
SSR_D71  [DO214AC]  not placed on the board
SSR_D72  [DO214AC]  not placed on the board
SSR_D73  [DO214AC]  not placed on the board
SSR_D74  [DO214AC]  not placed on the board
SSR_D75  [DO214AC]  not placed on the board
SSR_D76  [DO214AC]  not placed on the board
SSR_D77  [DO214AC]  not placed on the board
SSR_D78  [DO214AC]  not placed on the board
SSR_D79  [DO214AC]  not placed on the board
SSR_D80  [DO214AC]  not placed on the board
SSR_D81  [DO214AC]  not placed on the board
SSR_D82  [DO214AC]  not placed on the board
SSR_D83  [DO214AC]  not placed on the board
SSR_D84  [DO214AC]  not placed on the board
SSR_D85  [DO214AC]  not placed on the board
SSR_D86  [DO214AC]  not placed on the board
SSR_D87  [DO214AC]  not placed on the board
SSR_D88  [DO214AC]  not placed on the board
SSR_D89  [DO214AC]  not placed on the board
SSR_D90  [DO214AC]  not placed on the board
SSR_D91  [DO214AC]  not placed on the board
SSR_D92  [DO214AC]  not placed on the board
SSR_D93  [DO214AC]  not placed on the board
SSR_D94  [DO214AC]  not placed on the board
SSR_D95  [DO214AC]  not placed on the board
SSR_D96  [DO214AC]  not placed on the board
SSR_D97  [DO214AC]  not placed on the board
SSR_D98  [DO214AC]  not placed on the board
SSR_D99  [DO214AC]  not placed on the board
SSR_D100  [DO214AC]  not placed on the board
SSR_R1  [R0603]  8,160.1 0 top
SSR_R2  [R0603]  8.25,160.2 180 bottom
SSR_R3  [R0603]  not placed on the board
SSR_R4  [R0603]  not placed on the board
SSR_R5  [R0603]  not placed on the board
SSR_R6  [R0603]  not placed on the board
SSR_R7  [R0603]  not placed on the board
SSR_R8  [R0603]  not placed on the board
SSR_R9  [R0603]  not placed on the board
SSR_R10  [R0603]  not placed on the board
SSR_R11  [R0603]  not placed on the board
SSR_R12  [R0603]  not placed on the board
SSR_R13  [R0603]  not placed on the board
SSR_R14  [R0603]  not placed on the board
SSR_R15  [R0603]  not placed on the board
SSR_R16  [R0603]  not placed on the board
SSR_R17  [R0603]  not placed on the board
SSR_R18  [R0603]  not placed on the board
SSR_R19  [R0603]  not placed on the board
SSR_R20  [R0603]  not placed on the board
SSR_R21  [R0603]  not placed on the board
SSR_R22  [R0603]  not placed on the board
SSR_R23  [R0603]  not placed on the board
SSR_R24  [R0603]  not placed on the board
SSR_R25  [R0603]  not placed on the board
SSR_R26  [R0603]  not placed on the board
SSR_R27  [R0603]  not placed on the board
SSR_R28  [R0603]  not placed on the board
SSR_R29  [R0603]  not placed on the board
SSR_R30  [R0603]  not placed on the board
SSR_R31  [R0603]  not placed on the board
SSR_R32  [R0603]  not placed on the board
SSR_R33  [R0603]  not placed on the board
SSR_R34  [R0603]  not placed on the board
SSR_R35  [R0603]  not placed on the board
SSR_R36  [R0603]  not placed on the board
SSR_R37  [R0603]  not placed on the board
SSR_R38  [R0603]  not placed on the board
SSR_R39  [R0603]  not placed on the board
SSR_R40  [R0603]  not placed on the board
SSR_R41  [R0603]  not placed on the board
SSR_R42  [R0603]  not placed on the board
SSR_R43  [R0603]  not placed on the board
SSR_R44  [R0603]  not placed on the board
SSR_R45  [R0603]  not placed on the board
SSR_R46  [R0603]  not placed on the board
SSR_R47  [R0603]  not placed on the board
SSR_R48  [R0603]  not placed on the board
SSR_R49  [R0603]  not placed on the board
SSR_R50  [R0603]  not placed on the board
SSR_R51  [R0603]  not placed on the board
SSR_R52  [R0603]  not placed on the board
SSR_R53  [R0603]  not placed on the board
SSR_R54  [R0603]  not placed on the board
SSR_R55  [R0603]  not placed on the board
SSR_R56  [R0603]  not placed on the board
SSR_R57  [R0603]  not placed on the board
SSR_R58  [R0603]  not placed on the board
SSR_R59  [R0603]  not placed on the board
SSR_R60  [R0603]  not placed on the board
SSR_R61  [R0603]  not placed on the board
SSR_R62  [R0603]  not placed on the board
SSR_R63  [R0603]  not placed on the board
SSR_R64  [R0603]  not placed on the board
SSR_R65  [R0603]  not placed on the board
SSR_R66  [R0603]  not placed on the board
SSR_R67  [R0603]  not placed on the board
SSR_R68  [R0603]  not placed on the board
SSR_R69  [R0603]  not placed on the board
SSR_R70  [R0603]  not placed on the board
SSR_R71  [R0603]  not placed on the board
SSR_R72  [R0603]  not placed on the board
SSR_R73  [R0603]  not placed on the board
SSR_R74  [R0603]  not placed on the board
SSR_R75  [R0603]  not placed on the board
SSR_R76  [R0603]  not placed on the board
SSR_R77  [R0603]  not placed on the board
SSR_R78  [R0603]  not placed on the board
SSR_R79  [R0603]  not placed on the board
SSR_R80  [R0603]  not placed on the board
SSR_R81  [R0603]  not placed on the board
SSR_R82  [R0603]  not placed on the board
SSR_R83  [R0603]  not placed on the board
SSR_R84  [R0603]  not placed on the board
SSR_R85  [R0603]  not placed on the board
SSR_R86  [R0603]  not placed on the board
SSR_R87  [R0603]  not placed on the board
SSR_R88  [R0603]  not placed on the board
SSR_R89  [R0603]  not placed on the board
SSR_R90  [R0603]  not placed on the board
SSR_R91  [R0603]  not placed on the board
SSR_R92  [R0603]  not placed on the board
SSR_R93  [R0603]  not placed on the board
SSR_R94  [R0603]  not placed on the board
SSR_R95  [R0603]  not placed on the board
SSR_R96  [R0603]  not placed on the board
SSR_R97  [R0603]  not placed on the board
SSR_R98  [R0603]  not placed on the board
SSR_R99  [R0603]  not placed on the board
SSR_R100  [R0603]  not placed on the board
SSR_R101  [R0603]  not placed on the board
SSR_R102  [R0603]  not placed on the board
SSR_R103  [R0603]  not placed on the board
SSR_R104  [R0603]  not placed on the board
SSR_R105  [R0603]  not placed on the board
SSR_R106  [R0603]  not placed on the board
SSR_R107  [R0603]  not placed on the board
SSR_R108  [R0603]  not placed on the board
SSR_R109  [R0603]  not placed on the board
SSR_R110  [R0603]  not placed on the board
SSR_R111  [R0603]  not placed on the board
SSR_R112  [R0603]  not placed on the board
SSR_R113  [R0603]  not placed on the board
SSR_R114  [R0603]  not placed on the board
SSR_R115  [R0603]  not placed on the board
SSR_R116  [R0603]  not placed on the board
SSR_R117  [R0603]  not placed on the board
SSR_R118  [R0603]  not placed on the board
SSR_R119  [R0603]  not placed on the board
SSR_R120  [R0603]  not placed on the board
SSR_R121  [R0603]  not placed on the board
SSR_R122  [R0603]  not placed on the board
SSR_R123  [R0603]  not placed on the board
SSR_R124  [R0603]  not placed on the board
SSR_R125  [R0603]  not placed on the board
SSR_R126  [R0603]  not placed on the board
SSR_R127  [R0603]  not placed on the board
SSR_R128  [R0603]  not placed on the board
SSR_R129  [R0603]  not placed on the board
SSR_R130  [R0603]  not placed on the board
SSR_R131  [R0603]  not placed on the board
SSR_R132  [R0603]  not placed on the board
SSR_R133  [R0603]  not placed on the board
SSR_R134  [R0603]  not placed on the board
SSR_R135  [R0603]  not placed on the board
SSR_R136  [R0603]  not placed on the board
SSR_R137  [R0603]  not placed on the board
SSR_R138  [R0603]  not placed on the board
SSR_R139  [R0603]  not placed on the board
SSR_R140  [R0603]  not placed on the board
SSR_R141  [R0603]  not placed on the board
SSR_R142  [R0603]  not placed on the board
SSR_R143  [R0603]  not placed on the board
SSR_R144  [R0603]  not placed on the board
SSR_R145  [R0603]  not placed on the board
SSR_R146  [R0603]  not placed on the board
SSR_R147  [R0603]  not placed on the board
SSR_R148  [R0603]  not placed on the board
SSR_R149  [R0603]  not placed on the board
SSR_R150  [R0603]  not placed on the board
SSR_R151  [R0603]  not placed on the board
SSR_R152  [R0603]  not placed on the board
SSR_R153  [R0603]  not placed on the board
SSR_R154  [R0603]  not placed on the board
SSR_R155  [R0603]  not placed on the board
SSR_R156  [R0603]  not placed on the board
SSR_R157  [R0603]  not placed on the board
SSR_R158  [R0603]  not placed on the board
SSR_R159  [R0603]  not placed on the board
SSR_R160  [R0603]  not placed on the board
SSR_R161  [R0603]  not placed on the board
SSR_R162  [R0603]  not placed on the board
SSR_R163  [R0603]  not placed on the board
SSR_R164  [R0603]  not placed on the board
SSR_R165  [R0603]  not placed on the board
SSR_R166  [R0603]  not placed on the board
SSR_R167  [R0603]  not placed on the board
SSR_R168  [R0603]  not placed on the board
SSR_R169  [R0603]  not placed on the board
SSR_R170  [R0603]  not placed on the board
SSR_R171  [R0603]  not placed on the board
SSR_R172  [R0603]  not placed on the board
SSR_R173  [R0603]  not placed on the board
SSR_R174  [R0603]  not placed on the board
SSR_R175  [R0603]  not placed on the board
SSR_R176  [R0603]  not placed on the board
SSR_R177  [R0603]  not placed on the board
SSR_R178  [R0603]  not placed on the board
SSR_R179  [R0603]  not placed on the board
SSR_R180  [R0603]  not placed on the board
SSR_R181  [R0603]  not placed on the board
SSR_R182  [R0603]  not placed on the board
SSR_R183  [R0603]  not placed on the board
SSR_R184  [R0603]  not placed on the board
SSR_R185  [R0603]  not placed on the board
SSR_R186  [R0603]  not placed on the board
SSR_R187  [R0603]  not placed on the board
SSR_R188  [R0603]  not placed on the board
SSR_R189  [R0603]  not placed on the board
SSR_R190  [R0603]  not placed on the board
SSR_R191  [R0603]  not placed on the board
SSR_R192  [R0603]  not placed on the board
SSR_R193  [R0603]  not placed on the board
SSR_R194  [R0603]  not placed on the board
SSR_R195  [R0603]  not placed on the board
SSR_R196  [R0603]  not placed on the board
SSR_R197  [R0603]  not placed on the board
SSR_R198  [R0603]  not placed on the board
SSR_R199  [R0603]  not placed on the board
SSR_R200  [R0603]  not placed on the board
T1  [SOT23-BEC]  36.41,12.12 180 bottom
T2  [SOT23-BEC]  31.31,12.08 180 bottom
T3  [SOT23-BEC]  11.6,23.62 0 top
T9  [SOT23-BEC]  10.2,28.17 0 top
TP_V_SENSING  PTR1PAD1-13  [P1-13]  56,46 0 top
U1  DS1307  [DIL08]  53.43,21.84 180 top
U2  [RHT03_DHT-22]  69.2,20.4 180 top
U$1  ARDUINO_R3_SHIELD  [UNO_R3_SHIELD]  103.36,0.04 90 top
U$2  DCDCMODULE  [DCDCMODULE]  1.22,25.24 180 bottom
U$4  ESP8266  [ESP8266]  51.8,11.59 180 top
U$5  SIMHOLDER3  [SIMHOLDER3]  3.26,3.67 0 top
X1  [SMA90_DIP]  5.27,47.42 90 top